# Altium schematic sheet 02-ORIN_LOW_SPEED_SIGNAL.SchDoc: KARGOBOT-TBOX-V2.0
size 513 x 386 mm; Page Create Date: March  8, 1995; Page Number: 5; Page Size: C; Page Count: 81; RevCode: A; DsnPath: C:\Users\Administrator\Desktop\123\KARGOBOT-TCU-ORIN-V1.1.DSN; SchematicName: KARGOBT-TCU-ORIN-V1.1; PageName: 05-ORIN_LOW_SPEED_SIGNAL; PageSize: C; TopSchematic: True
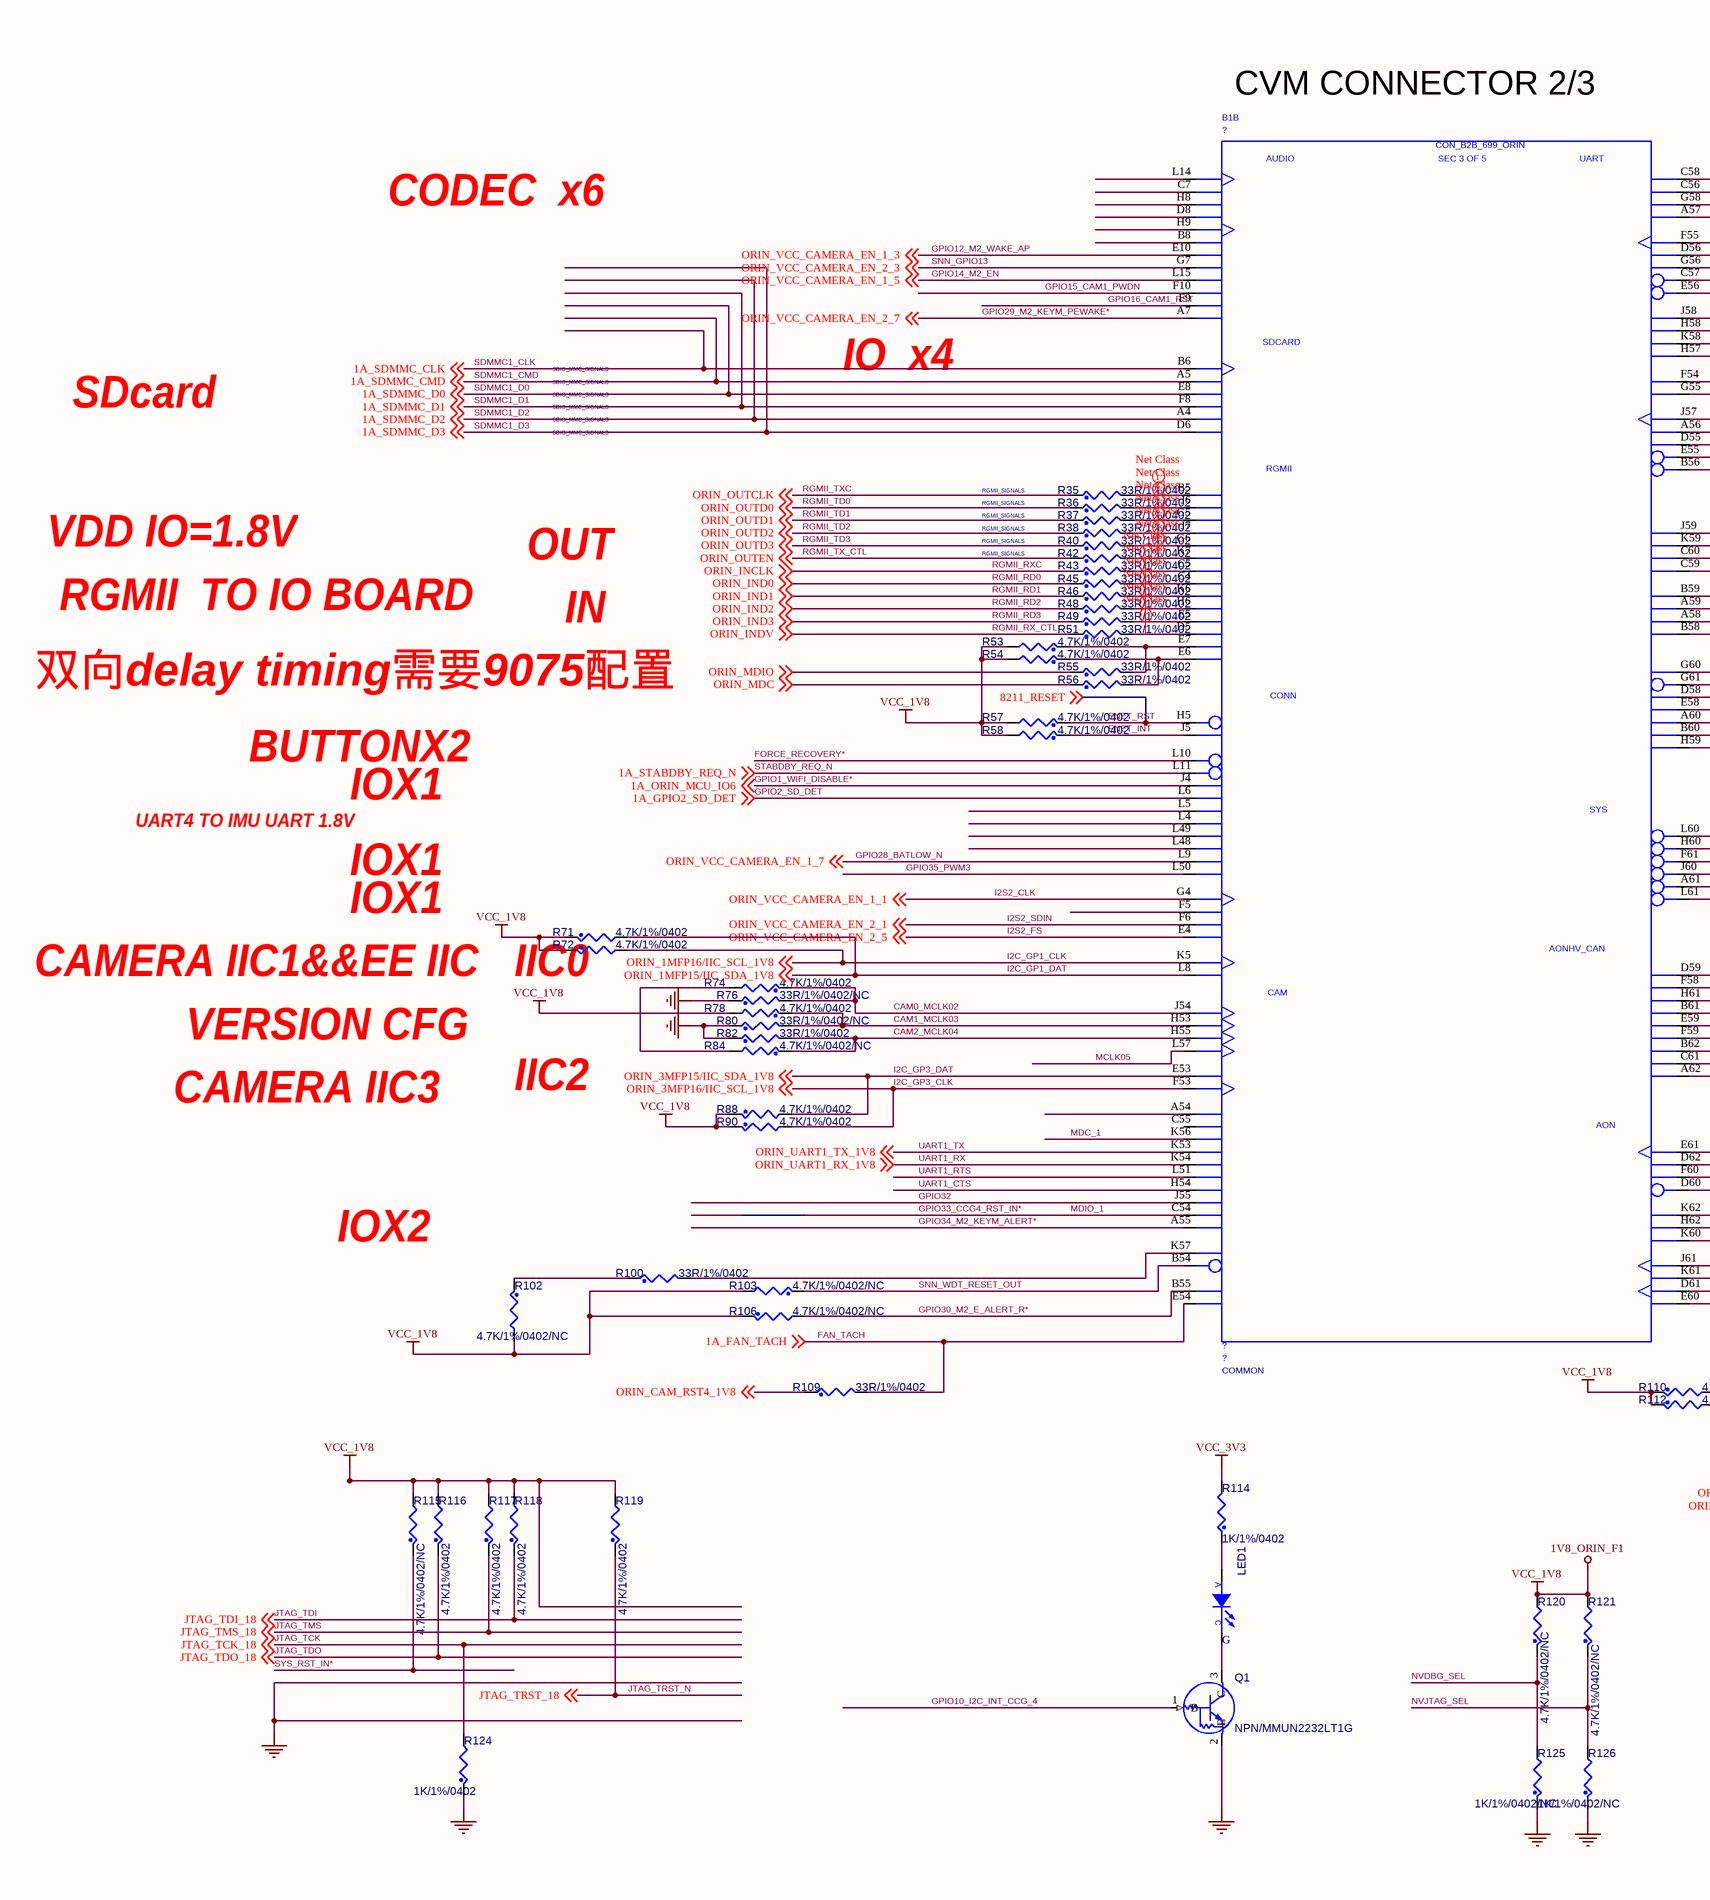
[diagram p0: 02-ORIN_LOW_SPEED_SIGNAL.SchDoc, left]
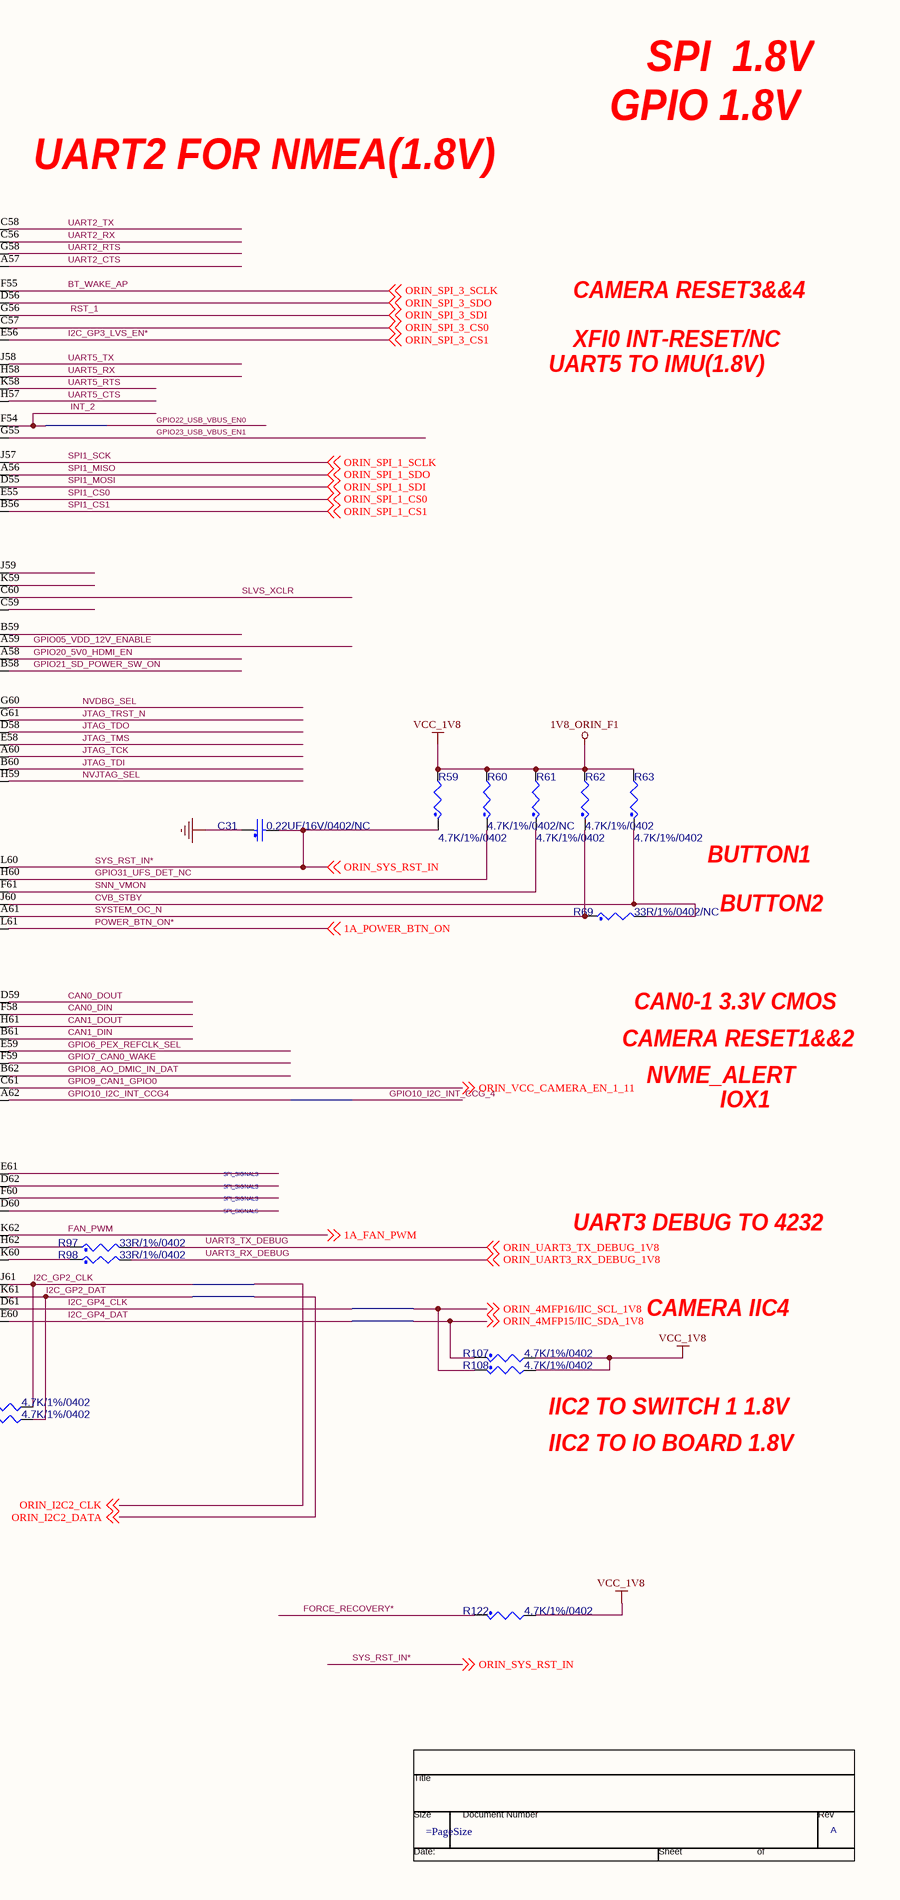
[diagram p1: 02-ORIN_LOW_SPEED_SIGNAL.SchDoc, right]

## Parts
*  RevCode: A  (graphical)
B1  SKU: COMMON  [CON_MIRMEZ_699_BGA_ST_P009_P013_P015_REVERSE]  (hidden comment: CON_B2B_699_ORIN)  (part B of 5)
C31  value 0.22UF/16V/0402/NC  [C0402]  (hidden comment: CAP_NP)
LED1  Value1: G  [LED0603]  (hidden comment: LED_P2_Dup1)
Q1  value NPN/MMUN2232LT1G  [SOT23-3-MMUN2232LT1G]  (hidden comment: DTC143ZE)
R35  value 33R/1%/0402  [R0402]  (hidden comment: RES_Dup2)
R36  value 33R/1%/0402  [R0402]  (hidden comment: RES_Dup2)
R37  value 33R/1%/0402  [R0402]  (hidden comment: RES_Dup2)
R38  value 33R/1%/0402  [R0402]  (hidden comment: RES_Dup2)
R40  value 33R/1%/0402  [R0402]  (hidden comment: RES_Dup2)
R42  value 33R/1%/0402  [R0402]  (hidden comment: RES_Dup2)
R43  value 33R/1%/0402  [R0402]  (hidden comment: RES_Dup2)
R45  value 33R/1%/0402  [R0402]  (hidden comment: RES_Dup2)
R46  value 33R/1%/0402  [R0402]  (hidden comment: RES_Dup2)
R48  value 33R/1%/0402  [R0402]  (hidden comment: RES_Dup2)
R49  value 33R/1%/0402  [R0402]  (hidden comment: RES_Dup2)
R51  value 33R/1%/0402  [R0402]  (hidden comment: RES_Dup2)
R53  value 4.7K/1%/0402  [R0402]  (hidden comment: RES_Dup2)
R54  value 4.7K/1%/0402  [R0402]  (hidden comment: RES_Dup2)
R55  value 33R/1%/0402  [R0402]  (hidden comment: RES_Dup2)
R56  value 33R/1%/0402  [R0402]  (hidden comment: RES_Dup2)
R57  value 4.7K/1%/0402  [R0402]  (hidden comment: RES_Dup2)
R58  value 4.7K/1%/0402  [R0402]  (hidden comment: RES_Dup2)
R59  value 4.7K/1%/0402  [R0402]  (hidden comment: RES_Dup2)
R60  value 4.7K/1%/0402/NC  [R0402]  (hidden comment: RES_Dup2)
R61  value 4.7K/1%/0402  [R0402]  (hidden comment: RES_Dup2)
R62  value 4.7K/1%/0402  [R0402]  (hidden comment: RES_Dup2)
R63  value 4.7K/1%/0402  [R0402]  (hidden comment: RES_Dup2)
R69  value 33R/1%/0402/NC  [R0402]  (hidden comment: RES_Dup2)
R71  value 4.7K/1%/0402  [R0402]  (hidden comment: RES_Dup2)
R72  value 4.7K/1%/0402  [R0402]  (hidden comment: RES_Dup2)
R74  value 4.7K/1%/0402  [R0402]  (hidden comment: RES_Dup2)
R76  value 33R/1%/0402/NC  [R0402]  (hidden comment: RES_Dup2)
R78  value 4.7K/1%/0402  [R0402]  (hidden comment: RES_Dup2)
R80  value 33R/1%/0402/NC  [R0402]  (hidden comment: RES_Dup2)
R82  value 33R/1%/0402  [R0402]  (hidden comment: RES_Dup2)
R84  value 4.7K/1%/0402/NC  [R0402]  (hidden comment: RES_Dup2)
R88  value 4.7K/1%/0402  [R0402]  (hidden comment: RES_Dup2)
R90  value 4.7K/1%/0402  [R0402]  (hidden comment: RES_Dup2)
R97  value 33R/1%/0402  [R0402]  (hidden comment: RES_Dup2)
R98  value 33R/1%/0402  [R0402]  (hidden comment: RES_Dup2)
R100  value 33R/1%/0402  [R0402]  (hidden comment: RES_Dup2)
R102  value 4.7K/1%/0402/NC  [R0402]  (hidden comment: RES_Dup2)
R103  value 4.7K/1%/0402/NC  [R0402]  (hidden comment: RES_Dup2)
R106  value 4.7K/1%/0402/NC  [R0402]  (hidden comment: RES_Dup2)
R107  value 4.7K/1%/0402  [R0402]  (hidden comment: RES_Dup2)
R108  value 4.7K/1%/0402  [R0402]  (hidden comment: RES_Dup2)
R109  value 33R/1%/0402  [R0402]  (hidden comment: RES_Dup2)
R110  value 4.7K/1%/0402  [R0402]  (hidden comment: RES_Dup2)
R112  value 4.7K/1%/0402  [R0402]  (hidden comment: RES_Dup2)
R114  value 1K/1%/0402  [R0402]  (hidden comment: RES_Dup2)
R115  value 4.7K/1%/0402/NC  [R0402]  (hidden comment: RES_Dup2)
R116  value 4.7K/1%/0402  [R0402]  (hidden comment: RES_Dup2)
R117  value 4.7K/1%/0402  [R0402]  (hidden comment: RES_Dup2)
R118  value 4.7K/1%/0402  [R0402]  (hidden comment: RES_Dup2)
R119  value 4.7K/1%/0402  [R0402]  (hidden comment: RES_Dup2)
R120  value 4.7K/1%/0402/NC  [R0402]  (hidden comment: RES_Dup2)
R121  value 4.7K/1%/0402/NC  [R0402]  (hidden comment: RES_Dup2)
R122  value 4.7K/1%/0402  [R0402]  (hidden comment: RES_Dup2)
R124  value 1K/1%/0402  [R0402]  (hidden comment: RES_Dup2)
R125  value 1K/1%/0402/NC  [R0402]  (hidden comment: RES_Dup2)
R126  value 1K/1%/0402/NC  [R0402]  (hidden comment: RES_Dup2)

## Nets
1V8_ORIN_F1: R53.2 R54.2 R57.2 R58.2 R59.2 R60.2 R61.2 R62.2 R63.2 R71.1 R72.1 R78.2 R88.1 R90.1 R102.2 R103.2 R106.1 R107.2 R108.2 R110.1 R112.1 R115.2 R116.2 R117.2 R118.2 R119.2 R120.2 R121.2 R122.2  [also labelled VCC_1V8]
GND: C31.1 Q1.2(E) R76.1 R80.1 R82.1 R124.1 R125.1 R126.1
VCC_3V3: R114.2
BT_WAKE_AP: B1.F55(SPI3_CLK) ; off-sheet ORIN_SPI_3_SCLK  [also labelled ORIN_SPI_3_SCLK]
CAM0_MCLK02: B1.J54(MCLK02) R74.1 R76.2
CAM1_MCLK03: B1.H53(MCLK03) R78.1 R80.2
CAM2_MCLK04: B1.H55(MCLK04) R82.2 R84.1
CAN0_DIN: B1.F58(CAN0_DIN)
CAN0_DOUT: B1.D59(CAN0_DOUT)
CAN1_DIN: B1.B61(CAN1_DIN)
CAN1_DOUT: B1.H61(CAN1_DOUT)
CVB_STBY: B1.J60(STANDBY_ACK_N) R63.1 R69.2
ENET_INT: B1.J5(ENET_INT) R58.1
ENET_RST: B1.H5(ENET_RST_N) R57.1 ; off-sheet 8211_RESET  [also labelled 8211_RESET]
FAN_PWM: B1.K62(FAN_PWM) ; off-sheet 1A_FAN_PWM  [also labelled 1A_FAN_PWM]
FAN_TACH: B1.E54(FAN_TACH) R109.2 ; off-sheet 1A_FAN_TACH  [also labelled 1A_FAN_TACH]
FORCE_RECOVERY*: B1.L10(FORCE_RECOVERY_N) R122.1
GPIO1_WIFI_DISABLE*: B1.J4(GPIO01) ; off-sheet 1A_ORIN_MCU_IO6  [also labelled 1A_ORIN_MCU_IO6]
GPIO2_SD_DET: B1.L6(GPIO02) ; off-sheet 1A_GPIO2_SD_DET  [also labelled 1A_GPIO2_SD_DET]
GPIO05_VDD_12V_ENABLE: B1.A59(GPIO05)
GPIO6_PEX_REFCLK_SEL: B1.E59(GPIO06)
GPIO7_CAN0_WAKE: B1.F59(GPIO07)
GPIO8_AO_DMIC_IN_DAT: B1.B62(GPIO08)
GPIO9_CAN1_GPIO0: B1.C61(GPIO09) ; off-sheet ORIN_VCC_CAMERA_EN_1_11  [also labelled ORIN_VCC_CAMERA_EN_1_11]
GPIO10_I2C_INT_CCG4: B1.A62(GPIO10) Q1.1(B)  [also labelled GPIO10_I2C_INT_CCG_4]
GPIO12_M2_WAKE_AP: B1.E10(GPIO12) ; off-sheet ORIN_VCC_CAMERA_EN_1_3  [also labelled ORIN_VCC_CAMERA_EN_1_3]
GPIO14_M2_EN: B1.L15(GPIO14) ; off-sheet ORIN_VCC_CAMERA_EN_1_5  [also labelled ORIN_VCC_CAMERA_EN_1_5]
GPIO15_CAM1_PWDN: B1.F10(GPIO15)
GPIO16_CAM1_RST: B1.F9(GPIO16)
GPIO20_5V0_HDMI_EN: B1.A58(GPIO20)
GPIO21_SD_POWER_SW_ON: B1.B58(GPIO21)
GPIO22_USB_VBUS_EN0: B1.F54(GPIO22)  [also labelled INT_2]
GPIO23_USB_VBUS_EN1: B1.G55(GPIO23)
GPIO28_BATLOW_N: B1.L9(GPIO28) ; off-sheet ORIN_VCC_CAMERA_EN_1_7  [also labelled ORIN_VCC_CAMERA_EN_1_7]
GPIO29_M2_KEYM_PEWAKE*: B1.A7(GPIO29) ; off-sheet ORIN_VCC_CAMERA_EN_2_7  [also labelled ORIN_VCC_CAMERA_EN_2_7]
GPIO30_M2_E_ALERT_R*: B1.B55(GPIO30) R106.2
GPIO31_UFS_DET_NC: B1.H60(GPIO31) R60.1
GPIO32: B1.J55(GPIO32)
GPIO33_CCG4_RST_IN*: B1.C54(GPIO33)  [also labelled MDIO_1]
GPIO34_M2_KEYM_ALERT*: B1.A55(GPIO34)
GPIO35_PWM3: B1.L50(GPIO35)
I2C_GP1_CLK: B1.K5(I2C1_CLK) R72.2 ; off-sheet ORIN_1MFP16/IIC_SCL_1V8  [also labelled ORIN_1MFP16/IIC_SCL_1V8]
I2C_GP1_DAT: B1.L8(I2C1_DAT) R71.2 ; off-sheet ORIN_1MFP15/IIC_SDA_1V8  [also labelled ORIN_1MFP15/IIC_SDA_1V8]
I2C_GP2_CLK: B1.J61(I2C2_CLK) R110.2 ; off-sheet ORIN_I2C2_CLK  [also labelled ORIN_I2C2_CLK]
I2C_GP2_DAT: B1.K61(I2C2_DAT) R112.2 ; off-sheet ORIN_I2C2_DATA  [also labelled ORIN_I2C2_DATA]
I2C_GP3_CLK: B1.F53(I2C3_CLK) R90.2 ; off-sheet ORIN_3MFP16/IIC_SCL_1V8  [also labelled ORIN_3MFP16/IIC_SCL_1V8]
I2C_GP3_DAT: B1.E53(I2C3_DAT) R88.2 ; off-sheet ORIN_3MFP15/IIC_SDA_1V8  [also labelled ORIN_3MFP15/IIC_SDA_1V8]
I2C_GP3_LVS_EN*: B1.E56(SPI3_CS1_N) ; off-sheet ORIN_SPI_3_CS1  [also labelled ORIN_SPI_3_CS1]
I2C_GP4_CLK: B1.D61(I2C4_CLK) R108.1 ; off-sheet ORIN_4MFP16/IIC_SCL_1V8  [also labelled ORIN_4MFP16/IIC_SCL_1V8]
I2C_GP4_DAT: B1.E60(I2C4_DAT) R107.1 ; off-sheet ORIN_4MFP15/IIC_SDA_1V8  [also labelled ORIN_4MFP15/IIC_SDA_1V8]
I2S2_CLK: B1.G4(I2S2_CLK) ; off-sheet ORIN_VCC_CAMERA_EN_1_1  [also labelled ORIN_VCC_CAMERA_EN_1_1]
I2S2_FS: B1.E4(I2S2_FS) ; off-sheet ORIN_VCC_CAMERA_EN_2_5  [also labelled ORIN_VCC_CAMERA_EN_2_5]
I2S2_SDIN: B1.F6(I2S2_DIN) ; off-sheet ORIN_VCC_CAMERA_EN_2_1  [also labelled ORIN_VCC_CAMERA_EN_2_1]
JTAG_TCK: B1.A60(JTAG_TCK) R124.2 ; off-sheet JTAG_TCK_18  [also labelled JTAG_TCK_18]
JTAG_TDI: B1.B60(JTAG_TDI) R118.1 ; off-sheet JTAG_TDI_18  [also labelled JTAG_TDI_18]
JTAG_TDO: B1.D58(JTAG_TDO) R116.1 ; off-sheet JTAG_TDO_18  [also labelled JTAG_TDO_18]
JTAG_TMS: B1.E58(JTAG_TMS) R117.1 ; off-sheet JTAG_TMS_18  [also labelled JTAG_TMS_18]
JTAG_TRST_N: B1.G61(JTAG_TRST_N) R119.1 ; off-sheet JTAG_TRST_18  [also labelled JTAG_TRST_18]
MCLK05: B1.L57(MCLK05)
MDC_1: B1.K56(GPIO19)
NVDBG_SEL: B1.G60(NVDBG_SEL) R120.1 R125.2
NVJTAG_SEL: B1.H59(NVJTAG_SEL) R121.1 R126.2
ORIN_CAM_RST4_1V8: R109.1 ; off-sheet ORIN_CAM_RST4_1V8
ORIN_MDC: R56.1 ; off-sheet ORIN_MDC
ORIN_MDIO: R55.1 ; off-sheet ORIN_MDIO
ORIN_SPI_3_CS0: B1.C57(SPI3_CS0_N) ; off-sheet ORIN_SPI_3_CS0
ORIN_SPI_3_SDO: B1.D56(SPI3_MISO) ; off-sheet ORIN_SPI_3_SDO
POWER_BTN_ON*: B1.L61(POWER_BTN_N) ; off-sheet 1A_POWER_BTN_ON  [also labelled 1A_POWER_BTN_ON]
RGMII_RD0: R45.1 ; off-sheet ORIN_IND0  [also labelled ORIN_IND0]
RGMII_RD1: R46.1 ; off-sheet ORIN_IND1  [also labelled ORIN_IND1]
RGMII_RD2: R48.1 ; off-sheet ORIN_IND2  [also labelled ORIN_IND2]
RGMII_RD3: R49.1 ; off-sheet ORIN_IND3  [also labelled ORIN_IND3]
RGMII_RX_CTL: R51.1 ; off-sheet ORIN_INDV  [also labelled ORIN_INDV]
RGMII_RXC: R43.1 ; off-sheet ORIN_INCLK  [also labelled ORIN_INCLK]
RGMII_TD0: R36.1 ; off-sheet ORIN_OUTD0  [also labelled ORIN_OUTD0]
RGMII_TD1: R37.1 ; off-sheet ORIN_OUTD1  [also labelled ORIN_OUTD1]
RGMII_TD2: R38.1 ; off-sheet ORIN_OUTD2  [also labelled ORIN_OUTD2]
RGMII_TD3: R40.1 ; off-sheet ORIN_OUTD3  [also labelled ORIN_OUTD3]
RGMII_TX_CTL: R42.1 ; off-sheet ORIN_OUTEN  [also labelled ORIN_OUTEN]
RGMII_TXC: R35.1 ; off-sheet ORIN_OUTCLK  [also labelled ORIN_OUTCLK]
RST_1: B1.G56(SPI3_MOSI) ; off-sheet ORIN_SPI_3_SDI  [also labelled ORIN_SPI_3_SDI]
SDMMC1_CLK: B1.B6(SDCARD_CLK) ; off-sheet 1A_SDMMC_CLK  [also labelled 1A_SDMMC_CLK]
SDMMC1_CMD: B1.A5(SDCARD_CMD) ; off-sheet 1A_SDMMC_CMD  [also labelled 1A_SDMMC_CMD]
SDMMC1_D0: B1.E8(SDCARD_D0) ; off-sheet 1A_SDMMC_D0  [also labelled 1A_SDMMC_D0]
SDMMC1_D1: B1.F8(SDCARD_D1) ; off-sheet 1A_SDMMC_D1  [also labelled 1A_SDMMC_D1]
SDMMC1_D2: B1.A4(SDCARD_D2) ; off-sheet 1A_SDMMC_D2  [also labelled 1A_SDMMC_D2]
SDMMC1_D3: B1.D6(SDCARD_D3) ; off-sheet 1A_SDMMC_D3  [also labelled 1A_SDMMC_D3]
SLVS_XCLR: B1.C60(I2S3_FS)
SNN_GPIO13: B1.G7(GPIO13) ; off-sheet ORIN_VCC_CAMERA_EN_2_3  [also labelled ORIN_VCC_CAMERA_EN_2_3]
SNN_VMON: B1.F61(VCOMP_ALERT_N) R61.1
SNN_WDT_RESET_OUT: B1.B54(WDT_RESET_OUT_N) R103.1
SPI1_CS0: B1.E55(SPI1_CS0_N) ; off-sheet ORIN_SPI_1_CS0  [also labelled ORIN_SPI_1_CS0]
SPI1_CS1: B1.B56(SPI1_CS1_N) ; off-sheet ORIN_SPI_1_CS1  [also labelled ORIN_SPI_1_CS1]
SPI1_MISO: B1.A56(SPI1_MISO) ; off-sheet ORIN_SPI_1_SDO  [also labelled ORIN_SPI_1_SDO]
SPI1_MOSI: B1.D55(SPI1_MOSI) ; off-sheet ORIN_SPI_1_SDI  [also labelled ORIN_SPI_1_SDI]
SPI1_SCK: B1.J57(SPI1_CLK) ; off-sheet ORIN_SPI_1_SCLK  [also labelled ORIN_SPI_1_SCLK]
STABDBY_REQ_N: B1.L11(STANDBY_REQ_N) ; off-sheet 1A_STABDBY_REQ_N  [also labelled 1A_STABDBY_REQ_N]
SYS_RST_IN*: B1.L60(SYS_RESET_N) C31.2 R59.1 R115.1 ; off-sheet ORIN_SYS_RST_IN  [also labelled ORIN_SYS_RST_IN]
SYSTEM_OC_N: B1.A61(SYSTEM_OC_N) R62.1 R69.1
UART1_CTS: B1.H54(UART1_CTS)
UART1_RTS: B1.L51(UART1_RTS)
UART1_RX: B1.K54(UART1_RX) ; off-sheet ORIN_UART1_RX_1V8  [also labelled ORIN_UART1_RX_1V8]
UART1_TX: B1.K53(UART1_TX) ; off-sheet ORIN_UART1_TX_1V8  [also labelled ORIN_UART1_TX_1V8]
UART2_CTS: B1.A57(UART2_CTS)
UART2_RTS: B1.G58(UART2_RTS)
UART2_RX: B1.C56(UART2_RX)
UART2_TX: B1.C58(UART2_TX)
UART3_RX_DEBUG: R98.2 ; off-sheet ORIN_UART3_RX_DEBUG_1V8  [also labelled ORIN_UART3_RX_DEBUG_1V8]
UART3_TX_DEBUG: R97.2 ; off-sheet ORIN_UART3_TX_DEBUG_1V8  [also labelled ORIN_UART3_TX_DEBUG_1V8]
UART5_CTS: B1.H57(UART5_CTS)
UART5_RTS: B1.K58(UART5_RTS)
UART5_RX: B1.H58(UART5_RX)
UART5_TX: B1.J58(UART5_TX)
NetB1_B5: B1.B5(RGMII_TXC) R35.2
NetB1_C4: B1.C4(RGMII_RD0) R45.2
NetB1_C5: B1.C5(RGMII_RXC) R43.2
NetB1_D5: B1.D5(RGMII_RX_CTL) R51.2
NetB1_E5: B1.E5(RGMII_RD3) R49.2
NetB1_E6: B1.E6(RGMII_SMA_MDC) R54.1 R56.2
NetB1_E7: B1.E7(RGMII_SMA_MDIO) R53.1 R55.2
NetB1_G5: B1.G5(RGMII_TD1) R37.2
NetB1_G6: B1.G6(RGMII_TD3) R40.2
NetB1_H6: B1.H6(RGMII_RD2) R48.2
NetB1_H62: B1.H62(UART3_TX_DEBUG) R97.1
NetB1_J6: B1.J6(RGMII_TD0) R36.2
NetB1_J7: B1.J7(RGMII_TD2) R38.2
NetB1_K6: B1.K6(RGMII_RD1) R46.2
NetB1_K7: B1.K7(RGMII_TX_CTL) R42.2
NetB1_K57: B1.K57(PWM01) R100.2
NetB1_K60: B1.K60(UART3_RX_DEBUG) R98.1
NetLED1_1: LED1.1(ANODE) R114.1
NetLED1_2: LED1.2(CATHODE) Q1.3(C)
NetR74_2: R74.2 R84.2
NetR100_1: R100.1 R102.1

Not connected (* = marked no-connect by the designer): B1 A54(GPIO17) B8(GPIO11) B59(GPIO04) C7(I2S1_SDOUT) C55(GPIO18) C59(I2S3_SCLK) D8(I2S1_FS) D60(SPI2_CS0_N) D62(SPI2_MISO) E61(SPI2_CLK) F5(I2S2_DOUT) F60(SPI2_MOSI) H8(I2S1_SDIN) H9(MCLK01) J59(I2S3_DIN) K59(I2S3_DOUT) L4(UART4_RTS) L5(UART4_TX) L14(I2S1_CLK) L48(UART4_RX) L49(UART4_CTS)

## Layout directives
net class RGMII_RX: NetB1_B5, NetB1_G5, NetB1_G6, NetB1_J6, NetB1_J7, NetB1_K7
net class RGMII_TX: NetB1_C4, NetB1_C5, NetB1_D5, NetB1_E5, NetB1_H6, NetB1_K6

## Notes on the sheet
- SPI  1.8V
- CVM CONNECTOR 2/3
- UART2 FOR NMEA(1.8V)
- GPIO 1.8V
- CODEC  x6
- CAMERA RESET3&&4
- XFI0 INT-RESET/NC
- SDIO_MMC_SIGNALS
- IO  x4
- UART5 TO IMU(1.8V)
- SDcard
- RGMII_SIGNALS
- VDD IO=1.8V
- OUT
- RGMII  TO IO BOARD
- IN
- 双向delay timing需要9075配置
- BUTTONX2
- IOX1
- UART4 TO IMU UART 1.8V
- BUTTON1
- BUTTON2
- CAMERA IIC1&&EE IIC
- IIC0
- CAN0-1 3.3V CMOS
- VERSION CFG
- CAMERA RESET1&&2
- NVME_ALERT
- CAMERA IIC3
- IIC2
- SPI_SIGNALS
- IOX2
- UART3 DEBUG TO 4232
- CAMERA IIC4
- IIC2 TO SWITCH 1 1.8V
- IIC2 TO IO BOARD 1.8V
- (in symbol CON_B2B_699, part B) AUDIO; SEC 3 OF 5; UART; SDCARD; RGMII; CONN; SYS; AONHV_CAN; CAM; AON
- (in symbol LED_P2_Dup1) A; C
- (in symbol TitleBlock0) Title; Size; Document Number; Rev; Date:; Sheet; of

## Library data of the parts
* = TitleBlock0: Title: KARGOBOT-TBOX-V2.0; Page Number: 5; Page Count: 81; Page Create Date: March  8, 1995; Page Size: =PageSize; Page Modify Date: =ModifiedDate
B1 = CON_B2B_699: 2034560003/MOLEX; Part Reference: B1; OriginalSymbolOrigin: (-500,1750); ASSEMBLY: ?; DEVICE: CON_B2B_699_ORIN; NV_PN: ?; PACK_TYPE: ?; PATH: ?; PLACEMENT_NOTE: ?; Value: CON_B2B_699_ORIN; PCB Footprint: CON_MIRMEZ_699_BGA_ST_P009_P013_P015_REVERSE
C31 = CAP_NP: GCM155R71C224KE02/MURATA; Part Reference: C2258; CLASS: DISCRETE; TOL: 10%; VOLTAGE: 16V; AGILE_PN: 150-75182; MFG_NAME01: AVX; MFG_PN01: 0402YC104KAT2A; CAD_APPROVED: Yes; FPLIST: CC0402_25,CC0402_HD,CC0402_CC; PCB Footprint: C0402; Tolerance: 10%; ROHS: Yes; HEIGHT: 0.635MM
LED1 = LED_P2_Dup1: NCD0603G1/NATIONSTAR; Part Reference: LED86; partgrade: 工业级; Partlifeflag: 1; Partname: 0603-LED-绿/RoHS; Partsort: CGJ; Mfr Part Number: 亿光_19-213/G6C-BM1N2B/3T; Erpitem: 外购; Pdm Number: 20.31.00.0001.02; Unit: pcs; Life State: 发布; Priority: 优选; 采购周期（天）: 30; 样品库: 样品库：2-4; 描述项5: 1.75~2.35V; 描述项4: 25mA; 描述项3: 高亮; 描述项2: 无色; 描述项1: 黄绿; MSD等级: 2级; ESD等级: HBM 2KV; 物料状态(样品、试用、在用、限用): 常规; 厂家（直接生产厂家或品牌）: 亿光; 计量单位: 只; 物料封装: 603; PCB Footprint: LED0603; Failure Rate: 16.926597; Version: A.0; 供应商(代理商): 都城亿光; 替代优先等级: 1; Part Type: 0603表贴LED; 规格型号: 亿光_19-213/G6C-BM1N2B/3T; 物料名称: 0603-LED-绿/ROHS; Part Number: 20.31.00.0001.02
Q1 = DTC143ZE: MMUN2232LT1G/ONSEMI; Part Reference: Q1; PCB Footprint: SOT23-3-MMUN2232LT1G
R35 = RES_Dup2: AC0402FR-0733RL/YAGEO; Part Reference: R46; CLASS: DISCRETE; SIGNAL_MODEL: DEFAULT_RESISTOR_33.000000OHM_2_1; FPLIST: RC0603_OV; CAD_APPROVED: Yes; MFG_PN01: CR-02FL6---33R; MFG_NAME01: YAGEO; Tolerance: 1%; AGILE_PN: 470-75790; TOL: 5%; ROHS: Yes; HEIGHT: 0.4MM; PCB Footprint: R0402
R36 = RES_Dup2: AC0402FR-0733RL/YAGEO; Part Reference: R47; CLASS: DISCRETE; SIGNAL_MODEL: DEFAULT_RESISTOR_33.000000OHM_2_1; FPLIST: RC0603_OV; CAD_APPROVED: Yes; MFG_PN01: CR-02FL6---33R; MFG_NAME01: YAGEO; Tolerance: 1%; AGILE_PN: 470-75790; TOL: 5%; ROHS: Yes; HEIGHT: 0.4MM; PCB Footprint: R0402
R37 = RES_Dup2: AC0402FR-0733RL/YAGEO; Part Reference: R48; CLASS: DISCRETE; SIGNAL_MODEL: DEFAULT_RESISTOR_33.000000OHM_2_1; FPLIST: RC0603_OV; CAD_APPROVED: Yes; MFG_PN01: CR-02FL6---33R; MFG_NAME01: YAGEO; Tolerance: 1%; AGILE_PN: 470-75790; TOL: 5%; ROHS: Yes; HEIGHT: 0.4MM; PCB Footprint: R0402
R38 = RES_Dup2: AC0402FR-0733RL/YAGEO; Part Reference: R49; CLASS: DISCRETE; SIGNAL_MODEL: DEFAULT_RESISTOR_33.000000OHM_2_1; FPLIST: RC0603_OV; CAD_APPROVED: Yes; MFG_PN01: CR-02FL6---33R; MFG_NAME01: YAGEO; Tolerance: 1%; AGILE_PN: 470-75790; TOL: 5%; ROHS: Yes; HEIGHT: 0.4MM; PCB Footprint: R0402
R40 = RES_Dup2: AC0402FR-0733RL/YAGEO; Part Reference: R51; CLASS: DISCRETE; SIGNAL_MODEL: DEFAULT_RESISTOR_33.000000OHM_2_1; FPLIST: RC0603_OV; CAD_APPROVED: Yes; MFG_PN01: CR-02FL6---33R; MFG_NAME01: YAGEO; Tolerance: 1%; AGILE_PN: 470-75790; TOL: 5%; ROHS: Yes; HEIGHT: 0.4MM; PCB Footprint: R0402
R42 = RES_Dup2: AC0402FR-0733RL/YAGEO; Part Reference: R53; CLASS: DISCRETE; SIGNAL_MODEL: DEFAULT_RESISTOR_33.000000OHM_2_1; FPLIST: RC0603_OV; CAD_APPROVED: Yes; MFG_PN01: CR-02FL6---33R; MFG_NAME01: YAGEO; Tolerance: 1%; AGILE_PN: 470-75790; TOL: 5%; ROHS: Yes; HEIGHT: 0.4MM; PCB Footprint: R0402
R43 = RES_Dup2: AC0402FR-0733RL/YAGEO; Part Reference: R55; CLASS: DISCRETE; TOL: 5%; AGILE_PN: 470-75790; Tolerance: 1%; MFG_NAME01: YAGEO; MFG_PN01: CR-02FL6---33R; CAD_APPROVED: Yes; FPLIST: RC0603_OV; SIGNAL_MODEL: DEFAULT_RESISTOR_33.000000OHM_2_1; HEIGHT: 0.4MM; ROHS: Yes; PCB Footprint: R0402
R45 = RES_Dup2: AC0402FR-0733RL/YAGEO; Part Reference: R57; CLASS: DISCRETE; TOL: 5%; AGILE_PN: 470-75790; Tolerance: 1%; MFG_NAME01: YAGEO; MFG_PN01: CR-02FL6---33R; CAD_APPROVED: Yes; FPLIST: RC0603_OV; SIGNAL_MODEL: DEFAULT_RESISTOR_33.000000OHM_2_1; HEIGHT: 0.4MM; ROHS: Yes; PCB Footprint: R0402
R46 = RES_Dup2: AC0402FR-0733RL/YAGEO; Part Reference: R58; CLASS: DISCRETE; TOL: 5%; AGILE_PN: 470-75790; Tolerance: 1%; MFG_NAME01: YAGEO; MFG_PN01: CR-02FL6---33R; CAD_APPROVED: Yes; FPLIST: RC0603_OV; SIGNAL_MODEL: DEFAULT_RESISTOR_33.000000OHM_2_1; HEIGHT: 0.4MM; ROHS: Yes; PCB Footprint: R0402
R48 = RES_Dup2: AC0402FR-0733RL/YAGEO; Part Reference: R60; CLASS: DISCRETE; TOL: 5%; AGILE_PN: 470-75790; Tolerance: 1%; MFG_NAME01: YAGEO; MFG_PN01: CR-02FL6---33R; CAD_APPROVED: Yes; FPLIST: RC0603_OV; SIGNAL_MODEL: DEFAULT_RESISTOR_33.000000OHM_2_1; HEIGHT: 0.4MM; ROHS: Yes; PCB Footprint: R0402
R49 = RES_Dup2: AC0402FR-0733RL/YAGEO; Part Reference: R62; CLASS: DISCRETE; TOL: 5%; AGILE_PN: 470-75790; Tolerance: 1%; MFG_NAME01: YAGEO; MFG_PN01: CR-02FL6---33R; CAD_APPROVED: Yes; FPLIST: RC0603_OV; SIGNAL_MODEL: DEFAULT_RESISTOR_33.000000OHM_2_1; HEIGHT: 0.4MM; ROHS: Yes; PCB Footprint: R0402
R51 = RES_Dup2: AC0402FR-0733RL/YAGEO; Part Reference: R64; CLASS: DISCRETE; TOL: 5%; AGILE_PN: 470-75790; Tolerance: 1%; MFG_NAME01: YAGEO; MFG_PN01: CR-02FL6---33R; CAD_APPROVED: Yes; FPLIST: RC0603_OV; SIGNAL_MODEL: DEFAULT_RESISTOR_33.000000OHM_2_1; HEIGHT: 0.4MM; ROHS: Yes; PCB Footprint: R0402
R53 = RES_Dup2: AC0402FR-074K7L/YAGEO; Part Reference: R66; CLASS: DISCRETE; FPLIST: RC0402_25,RC0402_HD,RC0402_CC; CAD_APPROVED: Yes; MFG_PN01: RK73B1ETTP472J; MFG_NAME01: KOA SPEER; Tolerance: 5%; AGILE_PN: 470-75626; ROHS: Yes; TOL: 5%; HEIGHT: 0.41mm; PCB Footprint: R0402
R54 = RES_Dup2: AC0402FR-074K7L/YAGEO; Part Reference: R67; CLASS: DISCRETE; FPLIST: RC0402_25,RC0402_HD,RC0402_CC; CAD_APPROVED: Yes; MFG_PN01: RK73B1ETTP472J; MFG_NAME01: KOA SPEER; Tolerance: 5%; AGILE_PN: 470-75626; ROHS: Yes; TOL: 5%; HEIGHT: 0.41mm; PCB Footprint: R0402
R55 = RES_Dup2: AC0402FR-0733RL/YAGEO; Part Reference: R68; CLASS: DISCRETE; TOL: 5%; AGILE_PN: 470-75790; Tolerance: 1%; MFG_NAME01: YAGEO; MFG_PN01: CR-02FL6---33R; CAD_APPROVED: Yes; FPLIST: RC0603_OV; SIGNAL_MODEL: DEFAULT_RESISTOR_33.000000OHM_2_1; PCB Footprint: R0402; HEIGHT: 0.4MM; ROHS: Yes
R56 = RES_Dup2: AC0402FR-0733RL/YAGEO; Part Reference: R69; CLASS: DISCRETE; TOL: 5%; AGILE_PN: 470-75790; Tolerance: 1%; MFG_NAME01: YAGEO; MFG_PN01: CR-02FL6---33R; CAD_APPROVED: Yes; FPLIST: RC0603_OV; SIGNAL_MODEL: DEFAULT_RESISTOR_33.000000OHM_2_1; PCB Footprint: R0402; HEIGHT: 0.4MM; ROHS: Yes
R57 = RES_Dup2: AC0402FR-074K7L/YAGEO; Part Reference: R70; CLASS: DISCRETE; FPLIST: RC0402_25,RC0402_HD,RC0402_CC; CAD_APPROVED: Yes; MFG_PN01: RK73B1ETTP472J; MFG_NAME01: KOA SPEER; Tolerance: 5%; AGILE_PN: 470-75626; ROHS: Yes; TOL: 5%; HEIGHT: 0.41mm; PCB Footprint: R0402
R58 = RES_Dup2: AC0402FR-074K7L/YAGEO; Part Reference: R71; CLASS: DISCRETE; FPLIST: RC0402_25,RC0402_HD,RC0402_CC; CAD_APPROVED: Yes; MFG_PN01: RK73B1ETTP472J; MFG_NAME01: KOA SPEER; Tolerance: 5%; AGILE_PN: 470-75626; ROHS: Yes; TOL: 5%; HEIGHT: 0.41mm; PCB Footprint: R0402
R59 = RES_Dup2: AC0402FR-074K7L/YAGEO; Part Reference: R72; CLASS: DISCRETE; FPLIST: RC0402_25,RC0402_HD,RC0402_CC; CAD_APPROVED: Yes; MFG_PN01: RK73B1ETTP472J; MFG_NAME01: KOA SPEER; Tolerance: 5%; AGILE_PN: 470-75626; PCB Footprint: R0402; ROHS: Yes; TOL: 5%; HEIGHT: 0.41mm
R60 = RES_Dup2: AC0402FR-074K7L/YAGEO; Part Reference: R73; CLASS: DISCRETE; FPLIST: RC0402_25,RC0402_HD,RC0402_CC; CAD_APPROVED: Yes; MFG_PN01: RK73B1ETTP472J; MFG_NAME01: KOA SPEER; Tolerance: 5%; AGILE_PN: 470-75626; ROHS: Yes; TOL: 5%; HEIGHT: 0.41mm; PCB Footprint: R0402
R61 = RES_Dup2: AC0402FR-074K7L/YAGEO; Part Reference: R74; CLASS: DISCRETE; FPLIST: RC0402_25,RC0402_HD,RC0402_CC; CAD_APPROVED: Yes; MFG_PN01: RK73B1ETTP472J; MFG_NAME01: KOA SPEER; Tolerance: 5%; AGILE_PN: 470-75626; PCB Footprint: R0402; ROHS: Yes; TOL: 5%; HEIGHT: 0.41mm
R62 = RES_Dup2: AC0402FR-074K7L/YAGEO; Part Reference: R75; CLASS: DISCRETE; TOL: 5%; AGILE_PN: 470-75626; MFG_NAME01: KOA SPEER; MFG_PN01: RK73B1ETTP472J; CAD_APPROVED: Yes; FPLIST: RC0402_25,RC0402_HD,RC0402_CC; HEIGHT: 0.41mm; Tolerance: 5%; ROHS: Yes; PCB Footprint: R0402
R63 = RES_Dup2: AC0402FR-074K7L/YAGEO; Part Reference: R76; CLASS: DISCRETE; FPLIST: RC0402_25,RC0402_HD,RC0402_CC; CAD_APPROVED: Yes; MFG_PN01: RK73B1ETTP472J; MFG_NAME01: KOA SPEER; Tolerance: 5%; AGILE_PN: 470-75626; PCB Footprint: R0402; ROHS: Yes; TOL: 5%; HEIGHT: 0.41mm
R69 = RES_Dup2: AC0402FR-0733RL/YAGEO; Part Reference: R81; CLASS: DISCRETE; TOL: 5%; AGILE_PN: 470-75790; Tolerance: 1%; MFG_NAME01: YAGEO; MFG_PN01: CR-02FL6---33R; CAD_APPROVED: Yes; FPLIST: RC0603_OV; SIGNAL_MODEL: DEFAULT_RESISTOR_33.000000OHM_2_1; HEIGHT: 0.4MM; ROHS: Yes; PCB Footprint: R0402
R71 = RES_Dup2: AC0402FR-074K7L/YAGEO; Part Reference: R10144; CLASS: DISCRETE; TOL: 5%; AGILE_PN: 470-75626; MFG_NAME01: KOA SPEER; MFG_PN01: RK73B1ETTP472J; CAD_APPROVED: Yes; FPLIST: RC0402_25,RC0402_HD,RC0402_CC; PCB Footprint: R0402; HEIGHT: 0.41mm; Tolerance: 5%; ROHS: Yes
R72 = RES_Dup2: AC0402FR-074K7L/YAGEO; Part Reference: R10145; CLASS: DISCRETE; FPLIST: RC0402_25,RC0402_HD,RC0402_CC; CAD_APPROVED: Yes; MFG_PN01: RK73B1ETTP472J; MFG_NAME01: KOA SPEER; Tolerance: 5%; AGILE_PN: 470-75626; PCB Footprint: R0402; ROHS: Yes; TOL: 5%; HEIGHT: 0.41mm
R74 = RES_Dup2: AC0402FR-074K7L/YAGEO; Part Reference: R84; CLASS: DISCRETE; FPLIST: RC0402_25,RC0402_HD,RC0402_CC; CAD_APPROVED: Yes; MFG_PN01: RK73B1ETTP472J; MFG_NAME01: KOA SPEER; Tolerance: 5%; AGILE_PN: 470-75626; ROHS: Yes; TOL: 5%; HEIGHT: 0.41mm; PCB Footprint: R0402
R76 = RES_Dup2: AC0402FR-0733RL/YAGEO; Part Reference: R86; CLASS: DISCRETE; SIGNAL_MODEL: DEFAULT_RESISTOR_33.000000OHM_2_1; FPLIST: RC0603_OV; CAD_APPROVED: Yes; MFG_PN01: CR-02FL6---33R; MFG_NAME01: YAGEO; Tolerance: 1%; AGILE_PN: 470-75790; TOL: 5%; ROHS: Yes; HEIGHT: 0.4MM; PCB Footprint: R0402
R78 = RES_Dup2: AC0402FR-074K7L/YAGEO; Part Reference: R88; CLASS: DISCRETE; FPLIST: RC0402_25,RC0402_HD,RC0402_CC; CAD_APPROVED: Yes; MFG_PN01: RK73B1ETTP472J; MFG_NAME01: KOA SPEER; Tolerance: 5%; AGILE_PN: 470-75626; ROHS: Yes; TOL: 5%; HEIGHT: 0.41mm; PCB Footprint: R0402
R80 = RES_Dup2: AC0402FR-0733RL/YAGEO; Part Reference: R90; CLASS: DISCRETE; TOL: 5%; AGILE_PN: 470-75790; Tolerance: 1%; MFG_NAME01: YAGEO; MFG_PN01: CR-02FL6---33R; CAD_APPROVED: Yes; FPLIST: RC0603_OV; SIGNAL_MODEL: DEFAULT_RESISTOR_33.000000OHM_2_1; HEIGHT: 0.4MM; ROHS: Yes; PCB Footprint: R0402
R82 = RES_Dup2: AC0402FR-0733RL/YAGEO; Part Reference: R92; CLASS: DISCRETE; SIGNAL_MODEL: DEFAULT_RESISTOR_33.000000OHM_2_1; FPLIST: RC0603_OV; CAD_APPROVED: Yes; MFG_PN01: CR-02FL6---33R; MFG_NAME01: YAGEO; Tolerance: 1%; AGILE_PN: 470-75790; TOL: 5%; PCB Footprint: R0402; ROHS: Yes; HEIGHT: 0.4MM
R84 = RES_Dup2: AC0402FR-074K7L/YAGEO; Part Reference: R94; CLASS: DISCRETE; TOL: 5%; AGILE_PN: 470-75626; MFG_NAME01: KOA SPEER; MFG_PN01: RK73B1ETTP472J; CAD_APPROVED: Yes; FPLIST: RC0402_25,RC0402_HD,RC0402_CC; PCB Footprint: R0402; HEIGHT: 0.41mm; Tolerance: 5%; ROHS: Yes
R88 = RES_Dup2: AC0402FR-074K7L/YAGEO; Part Reference: R10146; CLASS: DISCRETE; TOL: 5%; AGILE_PN: 470-75626; MFG_NAME01: KOA SPEER; MFG_PN01: RK73B1ETTP472J; CAD_APPROVED: Yes; FPLIST: RC0402_25,RC0402_HD,RC0402_CC; PCB Footprint: R0402; HEIGHT: 0.41mm; Tolerance: 5%; ROHS: Yes
R90 = RES_Dup2: AC0402FR-074K7L/YAGEO; Part Reference: R10147; CLASS: DISCRETE; FPLIST: RC0402_25,RC0402_HD,RC0402_CC; CAD_APPROVED: Yes; MFG_PN01: RK73B1ETTP472J; MFG_NAME01: KOA SPEER; Tolerance: 5%; AGILE_PN: 470-75626; PCB Footprint: R0402; ROHS: Yes; TOL: 5%; HEIGHT: 0.41mm
R97 = RES_Dup2: AC0402FR-0733RL/YAGEO; Part Reference: R109; CLASS: DISCRETE; TOL: 5%; AGILE_PN: 470-75790; Tolerance: 1%; MFG_NAME01: YAGEO; MFG_PN01: CR-02FL6---33R; CAD_APPROVED: Yes; FPLIST: RC0603_OV; SIGNAL_MODEL: DEFAULT_RESISTOR_33.000000OHM_2_1; HEIGHT: 0.4MM; ROHS: Yes; PCB Footprint: R0402
R98 = RES_Dup2: AC0402FR-0733RL/YAGEO; Part Reference: R110; CLASS: DISCRETE; SIGNAL_MODEL: DEFAULT_RESISTOR_33.000000OHM_2_1; FPLIST: RC0603_OV; CAD_APPROVED: Yes; MFG_PN01: CR-02FL6---33R; MFG_NAME01: YAGEO; Tolerance: 1%; AGILE_PN: 470-75790; TOL: 5%; ROHS: Yes; HEIGHT: 0.4MM; PCB Footprint: R0402
R100 = RES_Dup2: AC0402FR-0733RL/YAGEO; Part Reference: R112; CLASS: DISCRETE; TOL: 5%; AGILE_PN: 470-75790; Tolerance: 1%; MFG_NAME01: YAGEO; MFG_PN01: CR-02FL6---33R; CAD_APPROVED: Yes; FPLIST: RC0603_OV; SIGNAL_MODEL: DEFAULT_RESISTOR_33.000000OHM_2_1; HEIGHT: 0.4MM; ROHS: Yes; PCB Footprint: R0402
R102 = RES_Dup2: AC0402FR-074K7L/YAGEO; Part Reference: R114; CLASS: DISCRETE; TOL: 5%; AGILE_PN: 470-75626; MFG_NAME01: KOA SPEER; MFG_PN01: RK73B1ETTP472J; CAD_APPROVED: Yes; FPLIST: RC0402_25,RC0402_HD,RC0402_CC; HEIGHT: 0.41mm; Tolerance: 5%; ROHS: Yes; PCB Footprint: R0402
R103 = RES_Dup2: AC0402FR-074K7L/YAGEO; Part Reference: R115; CLASS: DISCRETE; FPLIST: RC0402_25,RC0402_HD,RC0402_CC; CAD_APPROVED: Yes; MFG_PN01: RK73B1ETTP472J; MFG_NAME01: KOA SPEER; Tolerance: 5%; AGILE_PN: 470-75626; ROHS: Yes; TOL: 5%; HEIGHT: 0.41mm; PCB Footprint: R0402
R106 = RES_Dup2: AC0402FR-074K7L/YAGEO; Part Reference: R118; CLASS: DISCRETE; FPLIST: RC0402_25,RC0402_HD,RC0402_CC; CAD_APPROVED: Yes; MFG_PN01: RK73B1ETTP472J; MFG_NAME01: KOA SPEER; Tolerance: 5%; AGILE_PN: 470-75626; ROHS: Yes; TOL: 5%; HEIGHT: 0.41mm; PCB Footprint: R0402
R107 = RES_Dup2: AC0402FR-074K7L/YAGEO; Part Reference: R10148; CLASS: DISCRETE; TOL: 5%; AGILE_PN: 470-75626; MFG_NAME01: KOA SPEER; MFG_PN01: RK73B1ETTP472J; CAD_APPROVED: Yes; FPLIST: RC0402_25,RC0402_HD,RC0402_CC; PCB Footprint: R0402; HEIGHT: 0.41mm; Tolerance: 5%; ROHS: Yes
R108 = RES_Dup2: AC0402FR-074K7L/YAGEO; Part Reference: R10149; CLASS: DISCRETE; FPLIST: RC0402_25,RC0402_HD,RC0402_CC; CAD_APPROVED: Yes; MFG_PN01: RK73B1ETTP472J; MFG_NAME01: KOA SPEER; Tolerance: 5%; AGILE_PN: 470-75626; PCB Footprint: R0402; ROHS: Yes; TOL: 5%; HEIGHT: 0.41mm
R109 = RES_Dup2: AC0402FR-0733RL/YAGEO; Part Reference: R10150; CLASS: DISCRETE; TOL: 5%; AGILE_PN: 470-75790; Tolerance: 1%; MFG_NAME01: YAGEO; MFG_PN01: CR-02FL6---33R; CAD_APPROVED: Yes; FPLIST: RC0603_OV; SIGNAL_MODEL: DEFAULT_RESISTOR_33.000000OHM_2_1; PCB Footprint: R0402; HEIGHT: 0.4MM; ROHS: Yes
R110 = RES_Dup2: AC0402FR-074K7L/YAGEO; Part Reference: R121; CLASS: DISCRETE; FPLIST: RC0402_25,RC0402_HD,RC0402_CC; CAD_APPROVED: Yes; MFG_PN01: RK73B1ETTP472J; MFG_NAME01: KOA SPEER; Tolerance: 5%; AGILE_PN: 470-75626; ROHS: Yes; TOL: 5%; HEIGHT: 0.41mm; PCB Footprint: R0402
R112 = RES_Dup2: AC0402FR-074K7L/YAGEO; Part Reference: R123; CLASS: DISCRETE; TOL: 5%; AGILE_PN: 470-75626; MFG_NAME01: KOA SPEER; MFG_PN01: RK73B1ETTP472J; CAD_APPROVED: Yes; FPLIST: RC0402_25,RC0402_HD,RC0402_CC; HEIGHT: 0.41mm; Tolerance: 5%; ROHS: Yes; PCB Footprint: R0402
R114 = RES_Dup2: AC0402FR-071KL/YAGEO; Part Reference: R130; CLASS: DISCRETE; AGILE_PN: 470-75626; Tolerance: 5%; MFG_NAME01: KOA SPEER; MFG_PN01: RK73B1ETTP472J; CAD_APPROVED: Yes; FPLIST: RC0402_25,RC0402_HD,0402_CC; ROHS: Yes; TOL: 5%; HEIGHT: 0.41mm; PCB Footprint: R0402
R115 = RES_Dup2: AC0402FR-074K7L/YAGEO; Part Reference: R125; CLASS: DISCRETE; FPLIST: RC0402_25,RC0402_HD,RC0402_CC; CAD_APPROVED: Yes; MFG_PN01: RK73B1ETTP472J; MFG_NAME01: KOA SPEER; Tolerance: 5%; AGILE_PN: 470-75626; ROHS: Yes; TOL: 5%; HEIGHT: 0.41mm; PCB Footprint: R0402
R116 = RES_Dup2: AC0402FR-074K7L/YAGEO; Part Reference: R126; CLASS: DISCRETE; TOL: 5%; AGILE_PN: 470-75626; MFG_NAME01: KOA SPEER; MFG_PN01: RK73B1ETTP472J; CAD_APPROVED: Yes; FPLIST: RC0402_25,RC0402_HD,RC0402_CC; HEIGHT: 0.41mm; Tolerance: 5%; ROHS: Yes; PCB Footprint: R0402
R117 = RES_Dup2: AC0402FR-074K7L/YAGEO; Part Reference: R127; CLASS: DISCRETE; FPLIST: RC0402_25,RC0402_HD,RC0402_CC; CAD_APPROVED: Yes; MFG_PN01: RK73B1ETTP472J; MFG_NAME01: KOA SPEER; Tolerance: 5%; AGILE_PN: 470-75626; ROHS: Yes; TOL: 5%; HEIGHT: 0.41mm; PCB Footprint: R0402
R118 = RES_Dup2: AC0402FR-074K7L/YAGEO; Part Reference: R128; CLASS: DISCRETE; FPLIST: RC0402_25,RC0402_HD,RC0402_CC; CAD_APPROVED: Yes; MFG_PN01: RK73B1ETTP472J; MFG_NAME01: KOA SPEER; Tolerance: 5%; AGILE_PN: 470-75626; ROHS: Yes; TOL: 5%; HEIGHT: 0.41mm; PCB Footprint: R0402
R119 = RES_Dup2: AC0402FR-074K7L/YAGEO; Part Reference: R129; CLASS: DISCRETE; TOL: 5%; AGILE_PN: 470-75626; MFG_NAME01: KOA SPEER; MFG_PN01: RK73B1ETTP472J; CAD_APPROVED: Yes; FPLIST: RC0402_25,RC0402_HD,RC0402_CC; HEIGHT: 0.41mm; Tolerance: 5%; ROHS: Yes; PCB Footprint: R0402
R120 = RES_Dup2: AC0402FR-074K7L/YAGEO; Part Reference: R131; CLASS: DISCRETE; TOL: 5%; AGILE_PN: 470-75626; MFG_NAME01: KOA SPEER; MFG_PN01: RK73B1ETTP472J; CAD_APPROVED: Yes; FPLIST: RC0402_25,RC0402_HD,RC0402_CC; HEIGHT: 0.41mm; Tolerance: 5%; ROHS: Yes; PCB Footprint: R0402
R121 = RES_Dup2: AC0402FR-074K7L/YAGEO; Part Reference: R132; CLASS: DISCRETE; FPLIST: RC0402_25,RC0402_HD,RC0402_CC; CAD_APPROVED: Yes; MFG_PN01: RK73B1ETTP472J; MFG_NAME01: KOA SPEER; Tolerance: 5%; AGILE_PN: 470-75626; ROHS: Yes; TOL: 5%; HEIGHT: 0.41mm; PCB Footprint: R0402
R122 = RES_Dup2: AC0402FR-074K7L/YAGEO; Part Reference: R7982; CLASS: DISCRETE; TOL: 5%; AGILE_PN: 470-75626; MFG_NAME01: KOA SPEER; MFG_PN01: RK73B1ETTP472J; CAD_APPROVED: Yes; FPLIST: RC0402_25,RC0402_HD,RC0402_CC; HEIGHT: 0.41mm; Tolerance: 5%; ROHS: Yes; PCB Footprint: R0402
R124 = RES_Dup2: AC0402FR-071KL/YAGEO; Part Reference: R134; CLASS: DISCRETE; FPLIST: RC0402_25,RC0402_HD,RC0402_CC; CAD_APPROVED: Yes; MFG_PN01: RK73B1ETTP472J; MFG_NAME01: KOA SPEER; Tolerance: 5%; AGILE_PN: 470-75626; ROHS: Yes; TOL: 5%; HEIGHT: 0.41mm; PCB Footprint: R0402
R125 = RES_Dup2: AC0402FR-071KL/YAGEO; Part Reference: R135; CLASS: DISCRETE; FPLIST: RC0402_25,RC0402_HD,RC0402_CC; CAD_APPROVED: Yes; MFG_PN01: RK73B1ETTP472J; MFG_NAME01: KOA SPEER; Tolerance: 5%; AGILE_PN: 470-75626; ROHS: Yes; TOL: 5%; HEIGHT: 0.41mm; PCB Footprint: R0402
R126 = RES_Dup2: AC0402FR-071KL/YAGEO; Part Reference: R136; CLASS: DISCRETE; TOL: 5%; AGILE_PN: 470-75626; MFG_NAME01: KOA SPEER; MFG_PN01: RK73B1ETTP472J; CAD_APPROVED: Yes; FPLIST: RC0402_25,RC0402_HD,RC0402_CC; HEIGHT: 0.41mm; Tolerance: 5%; ROHS: Yes; PCB Footprint: R0402